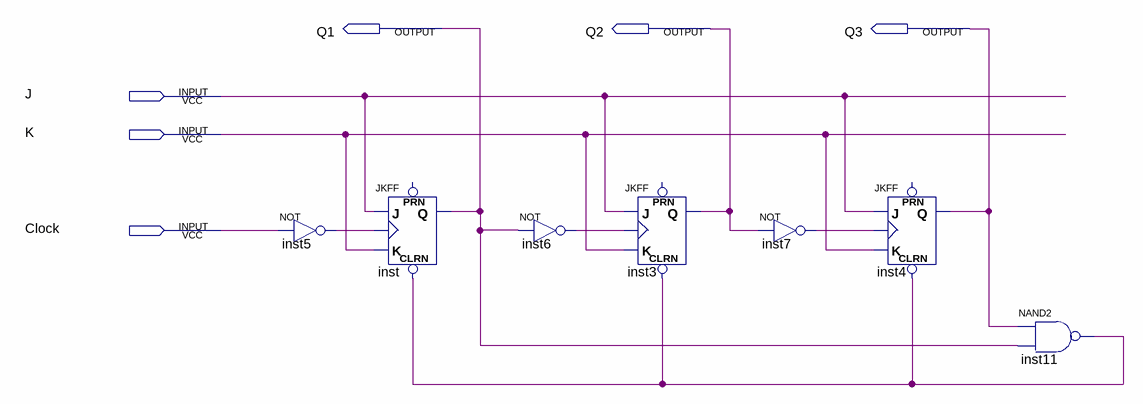
[diagram p0: schematic sheet]
// Quartus schematic counter.bdf as structural Verilog: 7 symbols, 6 pins
module counter (
  input  J,
  input  K,
  input  Clock,
  output Q1,
  output Q2,
  output Q3
);

  wire inst5_out, inst6_out, inst7_out, inst11_out;

  not inst5 (inst5_out, Clock);
  JKFF inst (.CLRN(inst11_out), .K(K), .J(J), .CLK(inst5_out), .Q(Q1));  // open: PRN
  not inst6 (inst6_out, Q1);
  JKFF inst3 (.CLRN(inst11_out), .K(K), .J(J), .CLK(inst6_out), .Q(Q2));  // open: PRN
  not inst7 (inst7_out, Q2);
  JKFF inst4 (.CLRN(inst11_out), .K(K), .J(J), .CLK(inst7_out), .Q(Q3));  // open: PRN
  nand inst11 (inst11_out, Q3, Q1);
endmodule
